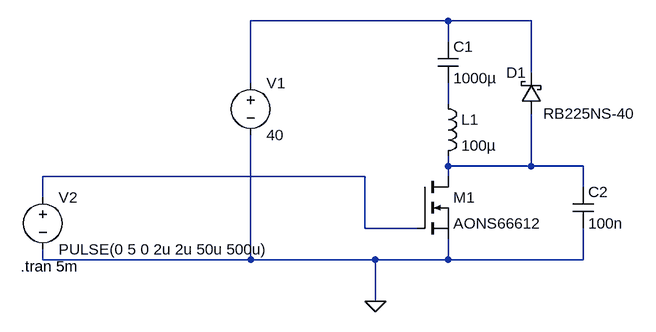
[diagram p0: schematic Step1.asc]
Step1.asc, the LTspice schematic file:
Version 4
SHEET 1 880 680
WIRE 224 48 -80 48
WIRE 352 48 224 48
WIRE 224 80 224 48
WIRE 352 128 352 48
WIRE -80 144 -80 48
WIRE 224 176 224 144
WIRE 224 272 224 256
WIRE 352 272 352 192
WIRE 352 272 224 272
WIRE 432 272 352 272
WIRE 96 288 -400 288
WIRE 224 288 224 272
WIRE 432 304 432 272
WIRE -400 320 -400 288
WIRE 96 368 96 288
WIRE 176 368 96 368
WIRE -400 416 -400 400
WIRE -80 416 -80 224
WIRE -80 416 -400 416
WIRE 112 416 -80 416
WIRE 224 416 224 384
WIRE 224 416 112 416
WIRE 432 416 432 368
WIRE 432 416 224 416
WIRE 112 480 112 416
FLAG 112 480 0
SYMBOL cap 208 80 R0
SYMATTR InstName C1
SYMATTR Value 1000µ
SYMBOL ind 208 160 R0
SYMATTR InstName L1
SYMATTR Value 100µ
SYMBOL schottky 368 192 R180
WINDOW 0 24 64 Left 2
WINDOW 3 -144 1 Left 2
SYMATTR InstName D1
SYMATTR Value RB225NS-40
SYMATTR Description Diode
SYMATTR Type diode
SYMBOL nmos 176 288 R0
SYMATTR InstName M1
SYMATTR Value AONS66612
SYMBOL voltage -80 128 R0
WINDOW 123 0 0 Left 0
WINDOW 39 0 0 Left 0
SYMATTR InstName V1
SYMATTR Value 40
SYMBOL voltage -400 304 R0
WINDOW 123 0 0 Left 0
WINDOW 39 0 0 Left 0
SYMATTR InstName V2
SYMATTR Value PULSE(0 5 0 2u 2u 50u 500u)
SYMBOL cap 416 304 R0
SYMATTR InstName C2
SYMATTR Value 100n
TEXT -434 426 Left 2 !.tran 5m

The netlist it stands for:
* Step1.asc
C1 N001 N002 1000µ
L1 N002 N003 100µ
D1 N003 N001 RB225NS-40
M1 N003 N004 0 0 AONS66612
V1 N001 0 40
V2 N004 0 PULSE(0 5 0 2u 2u 50u 500u)
C2 N003 0 100n
.model D D
.lib standard.dio
.model NMOS NMOS
.model PMOS PMOS
.lib standard.mos
.tran 5m
.backanno
.end